# EAGLE design rf315i (EAGLE 6.6.0)
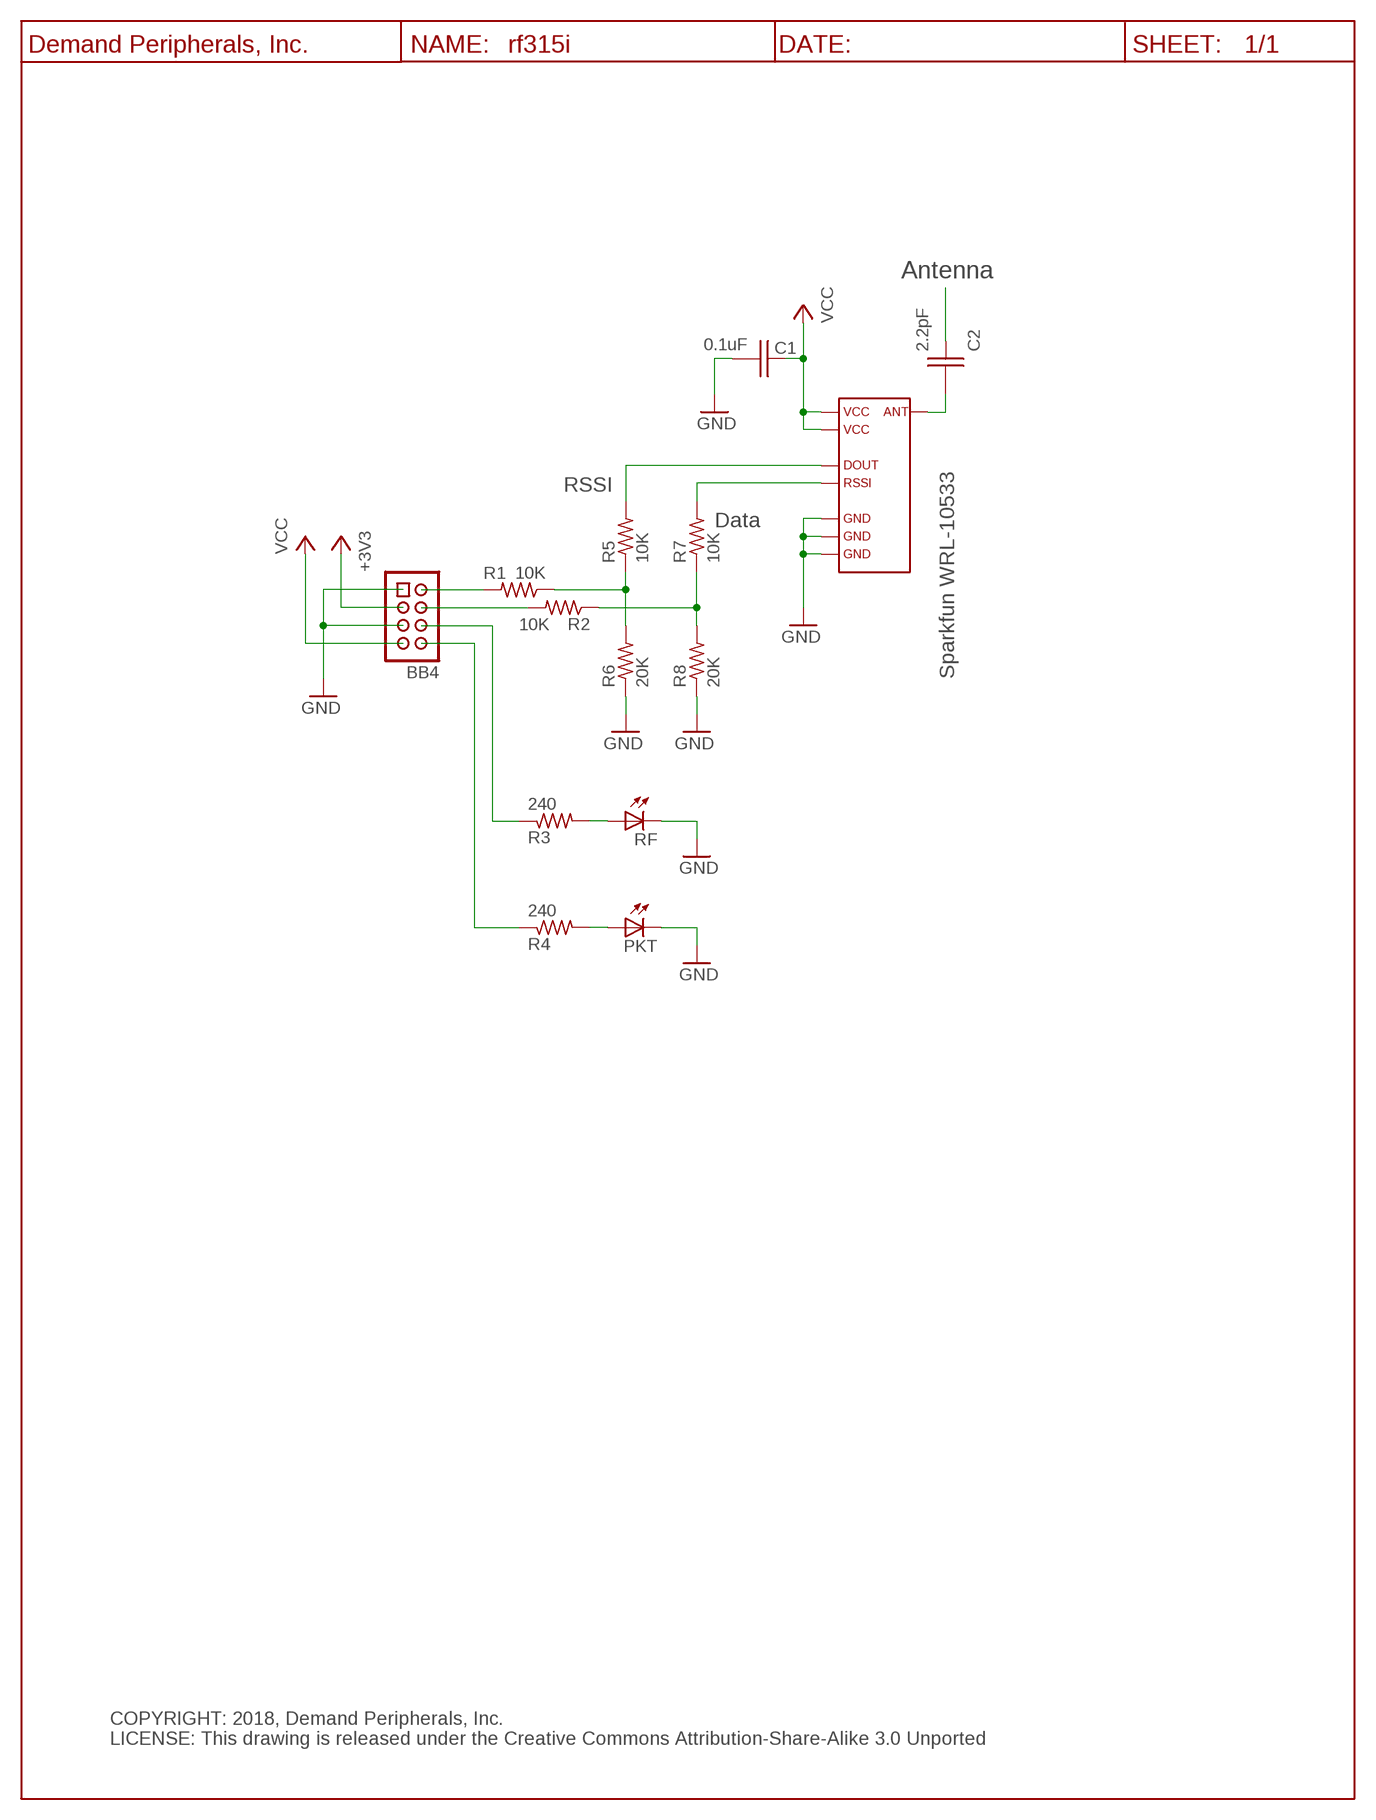
[diagram p0: schematic, sheet 1]

## Parts
BB4  Keyed_Pin_Header_4x2(0.1"x0.1")  HDR-4X2-SHR  [HDR-4X2]
C1  0.1uF  C0.1UF_C0603  [C0603]
C2  2.2pF  C2.2PF_C0603  [C0603]
PKT  LED-0805-RED  [0805]
R1  10K  R10K_R0603  [R0603]
R2  10K  R10K_R0603  [R0603]
R3  240  R240_  [R0603]
R4  240  R240_  [R0603]
R5  10K  R10K_R0603  [R0603]
R6  20K  R20K_R0603  [R0603]
R7  10K  R10K_R0603  [R0603]
R8  20K  R20K_R0603  [R0603]
RF  LED-0805-GRN  [0805]
RF1  WRL-10533  RFLINK  [RFLINK]
U$1  DP_FRAME_P  [P_FRAME]

## Nets
+3V3: BB4.3
GND: BB4.1 BB4.5 C1.2 PKT.C R6.1 R8.1 RF1.1(GND1) RF1.6(GND3) RF1.7(GND2) RF.C
N$1: R3.2 RF.A
N$2: BB4.6 R3.1
N$3: R7.2 RF1.3(RSSI)
N$4: R2.1 R7.1 R8.2
N$5: R1.1 R5.1 R6.2
N$6: R5.2 RF1.2(DOUT)
N$7: BB4.8 R4.1
N$8: PKT.A R4.2
N$9: BB4.2 R1.2
N$10: BB4.4 R2.2
N$11: C2.2 RF1.8(ANT)
N$12: C2.1
VCC: BB4.7 C1.1 RF1.4(VCC1) RF1.5(VCC2)

## Notes on the sheet
- Antenna
- RSSI
- Data
- Sparkfun WRL-10533
- COPYRIGHT: 2018, Demand Peripherals, Inc.
  LICENSE: This drawing is released under the Creative Commons Attribution-Share-Alike 3.0 Unported

## Library data of the parts
BB4 = dpi-conn:HDR-4X2-SHR: Shrouded 4x2 pin header; VENDOR: Digikey; VENDOR-PART-NUM: 609-3530-ND
C1 = dpi-passive:C0.1UF_: 0.1 uF Capacitor, 25V, X7R; VENDOR: Digikey; VENDOR-PART-NUM: 1276-1126-2-ND
C2 = dpi-passive:C2.2PF_: 2.2 pF Capacitor, 50V; VENDOR: Digikey; VENDOR-PART-NUM: 311-1739-1-ND
PKT = dpi-diopto:LED-0805-RED: Red 0805 LED, 41mcd@20ma, 160degree; VENDOR: Digikey; VENDOR-PART-NUM: 475-1415-6-ND
R1 R2 R5 R7 = dpi-passive:R10K_: 10K Resistor, 1%, 0.1 watt; VENDOR: Digikey; VENDOR-PART-NUM: 311-1.00KHRTR-ND
R3 R4 = dpi-passive:R240_: 240 Ohm resistor, 1%, 0.1 watt; VENDOR: Digikey; VENDOR-PART-NUM: 311-240HRTR-ND
R6 R8 = dpi-passive:R20K_: 20K Resistor, 1%, 0.1 watt; VENDOR: Digikey; VENDOR-PART-NUM: 311-20.0KHRTR-ND
RF = dpi-diopto:LED-0805-GRN: Green 0805 LED, 26mcd@20ma, 160degree; VENDOR: Digikey; VENDOR-PART-NUM: 475-1410-1-ND
RF1 = dpi-swsens:RFLINK: SparkFun RF-Link module or equivalent; VENDOR: Sparkfun; VENDOR-PART-NUM: WRL-10533
U$1 = dpi-sym:DP_FRAME_P: Portrait/Letter Document Frame

## Board
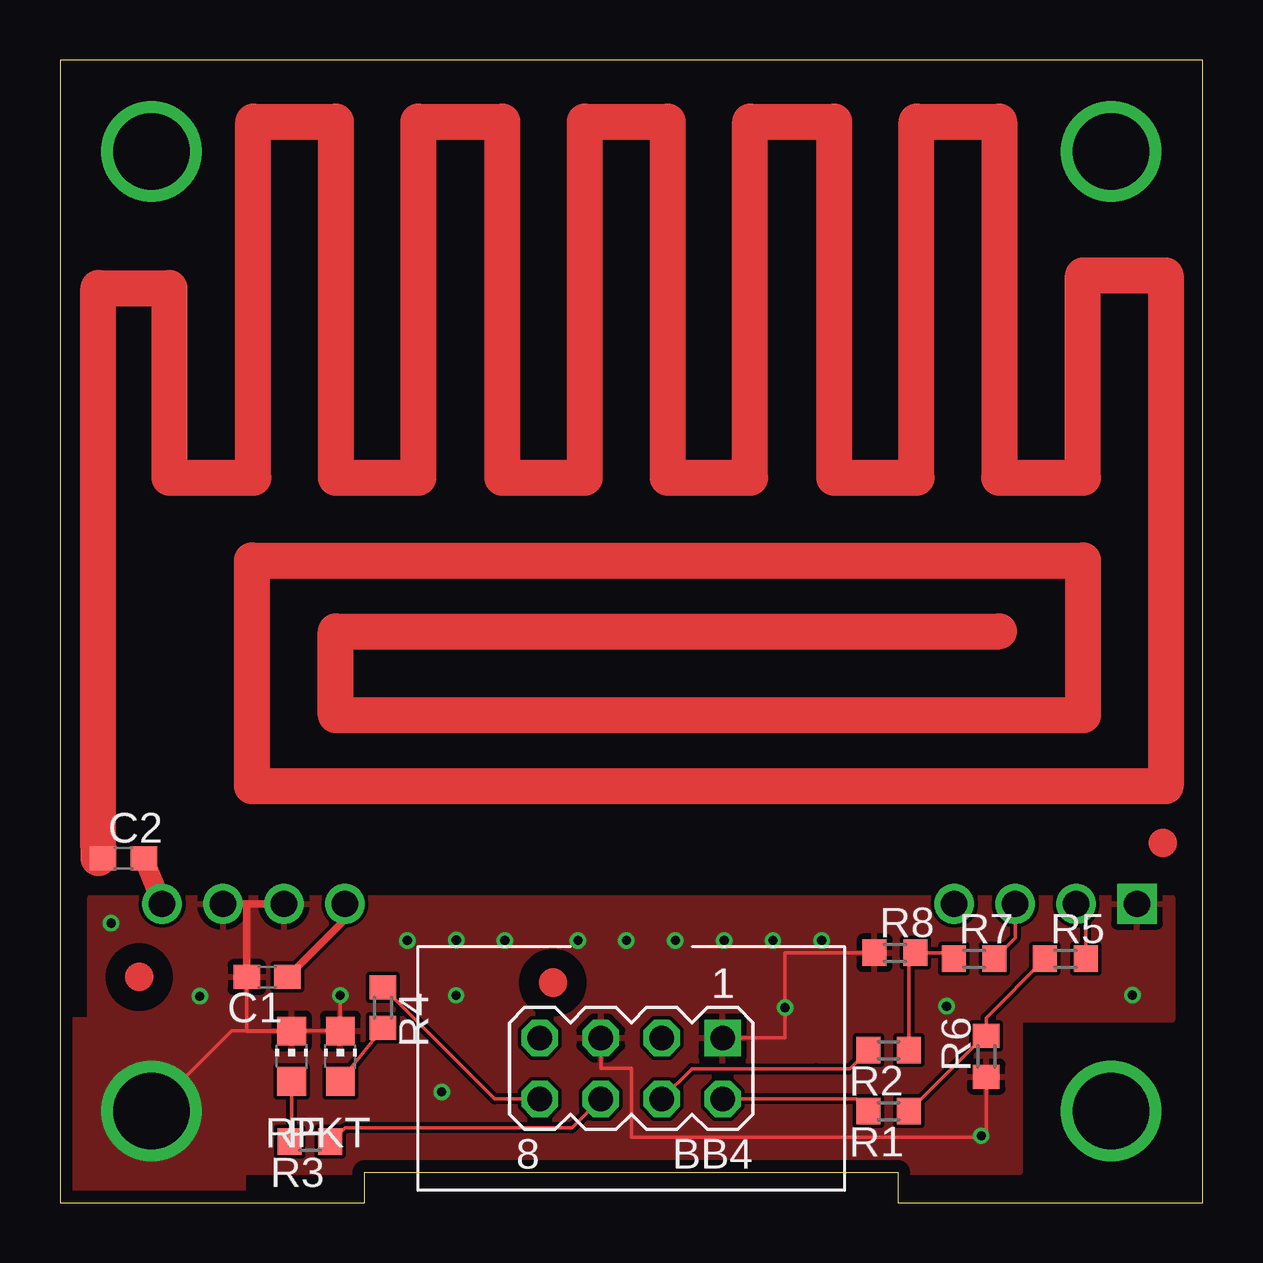
[diagram p1: board, top side]
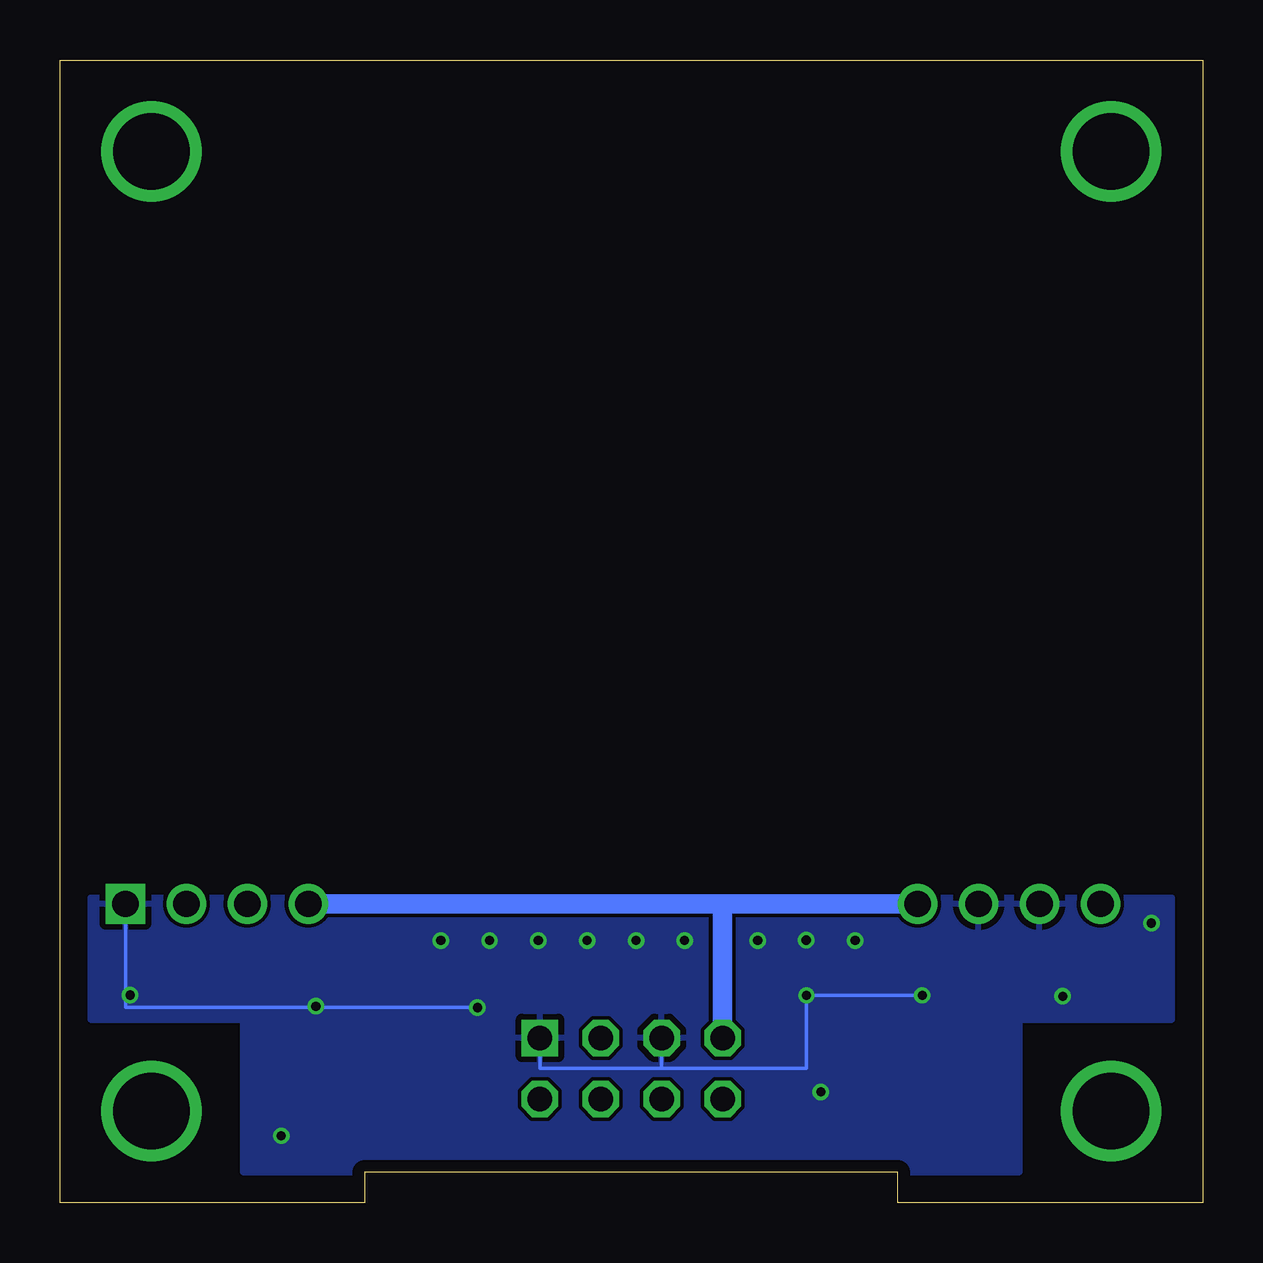
[diagram p2: board, bottom side, seen from below]

Size 47.62 x 47.62 mm. Coordinates in mm from the lower left corner, seen from the top.
Outline: 0,0 12.7,0 12.7,1.27 34.92,1.27 34.92,0 47.62,0 47.62,47.62 0,47.62 0,0
Copper layers (1*16): Top 0.035mm / dielectric 1.5mm / Bottom 0.035mm
Design rules "default *": minimum track width 6mil, minimum drill 15mil, track to track 6mil, track to pad 6mil, pad to pad 6mil, via to via 6mil, smd to smd 6mil, copper to edge 20mil, drill to drill 12mil, minimum pad ring 6mil, minimum via ring 6mil, stop-mask expansion 4mil, vias tented up to drill 0mil, thermal gap 10mil
tKeepout: area 15.1,0.1 to 32.5,9.2

### Footprints (pad centres in the part's own frame; a part is rotated, then mirrored left to right if it is on the bottom)
HDR-4X2 = drill 1.016 square: 1 -3.81,-1.27 | drill 1.016 octagon: 2 -3.81,1.27; 3 -1.27,-1.27; 4 -1.27,1.27; 5 1.27,-1.27; 6 1.27,1.27; 7 3.81,-1.27; 8 3.81,1.27
C0603 = smd 1.1 x 1: 1 -0.85,0; 2 0.85,0
0805 = smd 1.2 x 1.2: A -1.05,0; C 1.05,0
R0603 = smd 1 x 1.1: 1 -0.85,0; 2 0.85,0
RFLINK = drill 1.1 square: 1 -20.32,0 | drill 1.1: 2 -17.78,0; 3 -15.24,0; 4 -12.7,0; 5 12.7,0; 6 15.24,0; 7 17.78,0; 8 20.32,0

### Placement (x,y rotation side)
BB4  23.81,5.59 180 top
C1  8.64,9.4 180 top
C2  2.64,14.35 0 top
PKT  11.68,6.1 90 top
R1  34.54,3.81 180 top
R2  34.54,6.35 180 top
R3  10.41,2.54 180 top
R4  13.46,8.13 270 top
R5  41.91,10.16 0 top
R6  38.61,6.1 90 top
R7  38.1,10.16 0 top
R8  34.8,10.41 0 top
RF  9.65,6.1 90 top
RF1  24.57,12.45 180 top
U$1  -2.54,-2.54 0 top
U$2  [FIDUCIAL]  20.55,9.17 0 top
U$3  [FIDUCIAL]  45.97,14.99 0 top
U$4  [FIDUCIAL]  3.3,9.4 0 top
U$5  [DPI-2]  35.7,5.47 180 bottom

### Tracks (layer width: path | path; a pad name or v marks a point on that pad's centre or on a via)
GND  (via drill 0.38, 3.17)
  Top 0.152: v11.68,8.64 PKT.C RF.C 7.15,7.15 v3.81,3.81 | BB4.1 30.23,6.86 v30.23,8.13 30.23,10.41 R8.1 | R6.1 38.61,2.72 30.23,2.72 23.81,2.72 23.81,5.59 22.54,5.59 BB4.5 | C1.2 7.79,7.14 9.66,7.14
  Top 0.305: 7.79,12.45 C1.2 7.79,12.45 | 7.79,12.45 RF1.6 | 7.79,12.45 RF1.7
  Bottom 0.152: v11.68,8.64 v16.51,8.64 16.51,5.59 22.91,5.59 | RF1.1 44.9,8.13 v30.23,8.13 | 22.91,5.59 23.81,5.59 27.62,5.59 BB4.1 | BB4.5 22.54,5.59 22.91,5.59
  other vias: 31.75,10.92 29.72,10.92 27.69,10.92 25.65,10.92 23.61,10.92 21.59,10.92 18.54,10.92 16.52,10.93 15.91,4.61 38.4,2.78 2.13,11.65 5.83,8.6 44.7,8.65 36.96,8.18 14.48,10.92
  pour Top: 1.27,12.7 46.35,12.7 46.35,7.62 40.01,7.62 40.01,1.27 7.62,1.27 7.62,0.51 0.51,0.51 0.51,7.62 1.27,7.62
  pour Bottom: 1.27,12.7 46.35,12.7 46.35,7.62 40.01,7.62 40.01,1.27 7.62,1.27 7.62,7.62 1.27,7.62
MOUNT2  (via drill 3.17)
  other vias: 43.81,43.81
MOUNT3  (via drill 3.17)
  other vias: 43.81,3.81
MOUNT4  (via drill 3.17)
  other vias: 3.81,43.81
N$1
  Top 0.152: R3.2 9.65,2.64 RF.A
N$2
  Top 0.152: BB4.6 21.34,3.11 11.89,3.11 11.32,2.54 R3.1
N$3
  Top 0.152: RF1.3 39.81,11.02 R7.2
N$4
  Top 0.152: R7.1 37,10.41 R8.2 35.39,10.16 R2.1
N$5
  Top 0.152: R5.1 38.61,7.71 R6.2 38.53,6.95 R1.1
N$6
  Top 0.152: R5.2 42.76,12.04 RF1.2
N$7
  Top 0.152: BB4.8 18.12,4.32 R4.1
N$8
  Top 0.152: PKT.A R4.2
N$9
  Top 0.152: R1.2 33.19,4.32 BB4.2
N$10
  Top 0.152: BB4.4 26.34,5.58 31.52,5.58 32.92,5.58 R2.2
N$11
  Top 0.813: C2.2 RF1.8
N$17
  Top 1.5: 1.6,14.78 1.6,38.12 4.56,38.12 4.56,30.21 8.05,30.21 8.05,45.05 11.5,45.05 11.5,30.21 14.94,30.21 14.94,45.05 18.43,45.05 18.43,30.21 21.88,30.21 21.88,45.05 25.32,45.05 25.32,30.21 28.77,30.21 28.77,45.05 32.26,45.05 32.26,30.21 35.71,30.21 35.71,45.05 39.15,45.05 39.15,30.21 42.64,30.21 42.64,38.65 46.09,38.65 46.09,17.35 8.01,17.35 8.01,26.76 42.64,26.76 42.64,20.31 11.5,20.31 11.5,23.8 39.15,23.8
N$18
  Top 1.5: 1.6,14.78 1.6,14.36
VCC
  Top 0.305: C1.1 11.87,11.79 RF1.5
  Bottom 0.813: RF1.5 20.23,12.45 | 20.23,12.45 RF1.4 | BB4.7 20,12.45 20.23,12.45

### Text on the board
tTest: 1.875 Inches | 1.575 Inches | Rev 17A | RF315i | Sung Oh | (C) 2017, Demand Peripherals, Inc. | C2 | 1.575 Inches | 1.875 Inches | R8 | C1 | R4 | R7 | R5 | R2 | RF | R6 | Pkt | R3 | BB4 | R1
215bmp: /home/bsmith/antenna.bmp